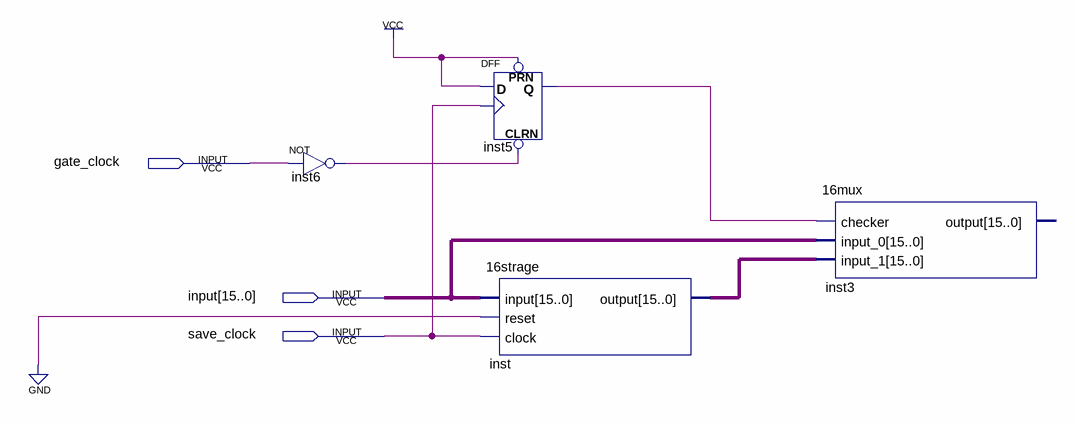
[diagram p0: schematic sheet]
// Quartus schematic ir_top.bdf as structural Verilog: 4 symbols, 3 pins
module ir_top (
  input  gate_clock,
  input  [15:0] \input ,
  input  save_clock
);

  wire inst5_q, inst6_out;
  wire [15:0] inst_output;

  not inst6 (inst6_out, gate_clock);
  DFF inst5 (.CLRN(inst6_out), .CLK(save_clock), .D(1'b1), .PRN(1'b1), .Q(inst5_q));
  \16strage  inst (.\input (\input ), .reset(1'b0), .clock(save_clock), .\output (inst_output));
  \16mux  inst3 (.\checker (inst5_q), .input_0(\input ), .input_1(inst_output));  // open: output
endmodule
